# Altium project Lıne Detect Sensor.PrjPcb
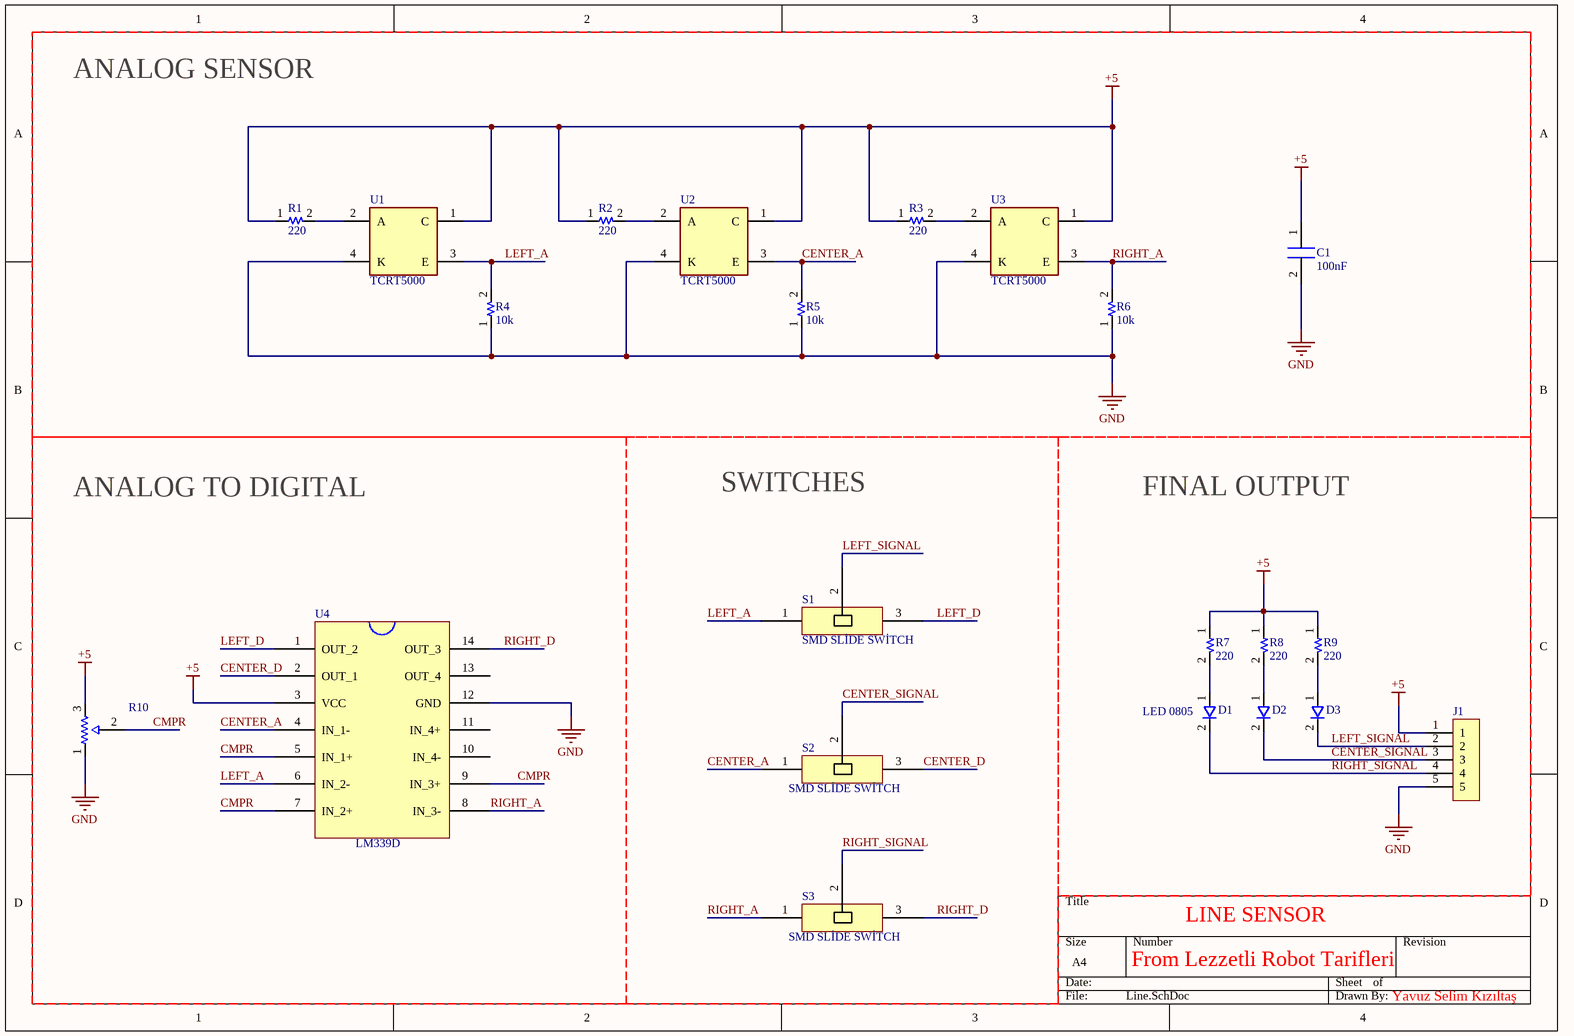
[diagram p0: Line.SchDoc]
1 sheet, 22 parts. Net scope: global (net labels, ports and power ports of the same name join across sheets).
Board file: Line.PcbDoc

## Sheet Line.SchDoc
size A4; SheetNumber: 1; SheetTotal: 1

### Parts
C1  100nF  [C0805]
D1  LED 0805  [LED 0805]
D2  LED 0805  [LED 0805]  (value not drawn)
D3  LED 0805  [LED 0805]  (value not drawn)
J1  1x5 MALE HEADER  [1x5 MALE HEADER]  (value not drawn)
R1  220  [R0805 Resistor]
R2  220  [R0805 Resistor]
R3  220  [R0805 Resistor]
R4  10k  [R0805 Resistor]
R5  10k  [R0805 Resistor]
R6  10k  [R0805 Resistor]
R7  220  [R0805 Resistor]
R8  220  [R0805 Resistor]
R9  220  [R0805 Resistor]
R10  TRIMPOT 5mm  [TRIMPOT 5mm]  (value not drawn)
S1  SMD SLİDE SWİTCH  [SMD Slide Switch]
S2  SMD SLİDE SWİTCH  [SMD Slide Switch]
S3  SMD SLİDE SWİTCH  [SMD Slide Switch]
U1  TCRT5000  [TCRT5000]
U2  TCRT5000  [TCRT5000]
U3  TCRT5000  [TCRT5000]
U4  LM339D  [LM339D]

### Nets
+5: C1.1 J1.1 R1.1 R2.1 R3.1 R7.1 R8.1 R9.1 R10.3 U1.1(C) U2.1(C) U3.1(C) U4.3(VCC)
GND: C1.2 J1.5 R4.1 R5.1 R6.1 R10.1 U1.4(K) U2.4(K) U3.4(K) U4.12(GND)
CENTER_A: R5.2 S2.1(VSS) U2.3(E) U4.4(IN_1-)
CENTER_D: S2.3(VSS) U4.2(OUT_1)
CENTER_SIGNAL: D2.2 J1.3 S2.2(VSS)
CMPR: R10.2 U4.5(IN_1+) U4.7(IN_2+) U4.9(IN_3+)
LEFT_A: R4.2 S1.1(VSS) U1.3(E) U4.6(IN_2-)
LEFT_D: S1.3(VSS) U4.1(OUT_2)
LEFT_SIGNAL: D3.2 J1.2 S1.2(VSS)
RIGHT_A: R6.2 S3.1(VSS) U3.3(E) U4.8(IN_3-)
RIGHT_D: S3.3(VSS) U4.14(OUT_3)
RIGHT_SIGNAL: D1.2 J1.4 S3.2(VSS)
NetD1_1: D1.1 R7.2
NetD2_1: D2.1 R8.2
NetD3_1: D3.1 R9.2
NetR1_2: R1.2 U1.2(A)
NetR2_2: R2.2 U2.2(A)
NetR3_2: R3.2 U3.2(A)

Not connected (* = marked no-connect by the designer): U4 10(IN_4-) 11(IN_4+) 13(OUT_4)

### Notes on the sheet
- ANALOG SENSOR
- ANALOG TO DIGITAL
- SWITCHES
- FINAL OUTPUT
- LINE SENSOR
- From Lezzetli Robot Tarifleri
- Yavuz Selim Kızıltaş

### Library data of the parts
C1 = C0805
R1-R9 = R0805 Resistor
R10 = TRIMPOT 5mm: TS53 TRIMPOT SMD 5mm
U1-U3 = TCRT5000: TCRT5000 Kızıl Ötesi Sensör; Manufacturer: Vishay; Current - DC Forward: 60mA; Current - Collector: 100mA; Voltage - Collector Emitter Breakdown: 70V; helpURL: https://upverter.com/upn/revision/6a006743d406fff5/; ComponentLink2Description: Datasheet; Temperature: -25°C to +85°C; Package: PTH_SENSOR_10MM2_5MM8; Supplier 2: Mouser; Price: 0.712554698297; Supplier 1: Digi-Key; ComponentLink1URL: https://upverter.com/upn/revision/6a006743d406fff5/; Supplier Part Number 2: 782-TCRT5000; Supplier Part Number 1: 751-1033-5-ND; ComponentLink1Description: Upverter; ComponentLink2URL: http://www.vishay.com/doc?83760; RoHS: TRUE; Mouser Part Number: 782-TCRT5000; Temperature Range High: +85°C; Digikey Description: IC SENSOR OPTO TRANS 15MM REFL PCB; Digikey Part Number: 751-1033-5-ND; Lead Free: yes; Temperature Range Low: -25°C; Part Number: TCRT5000
U4 = LM339D: LM33D Voltage Comparator